# Altium schematic sheet ZHSD-ZYNQ-PWR.SchDoc
size A3; DocumentNumber: 3; SheetNumber: 3; SheetTotal: 17; Size: A3
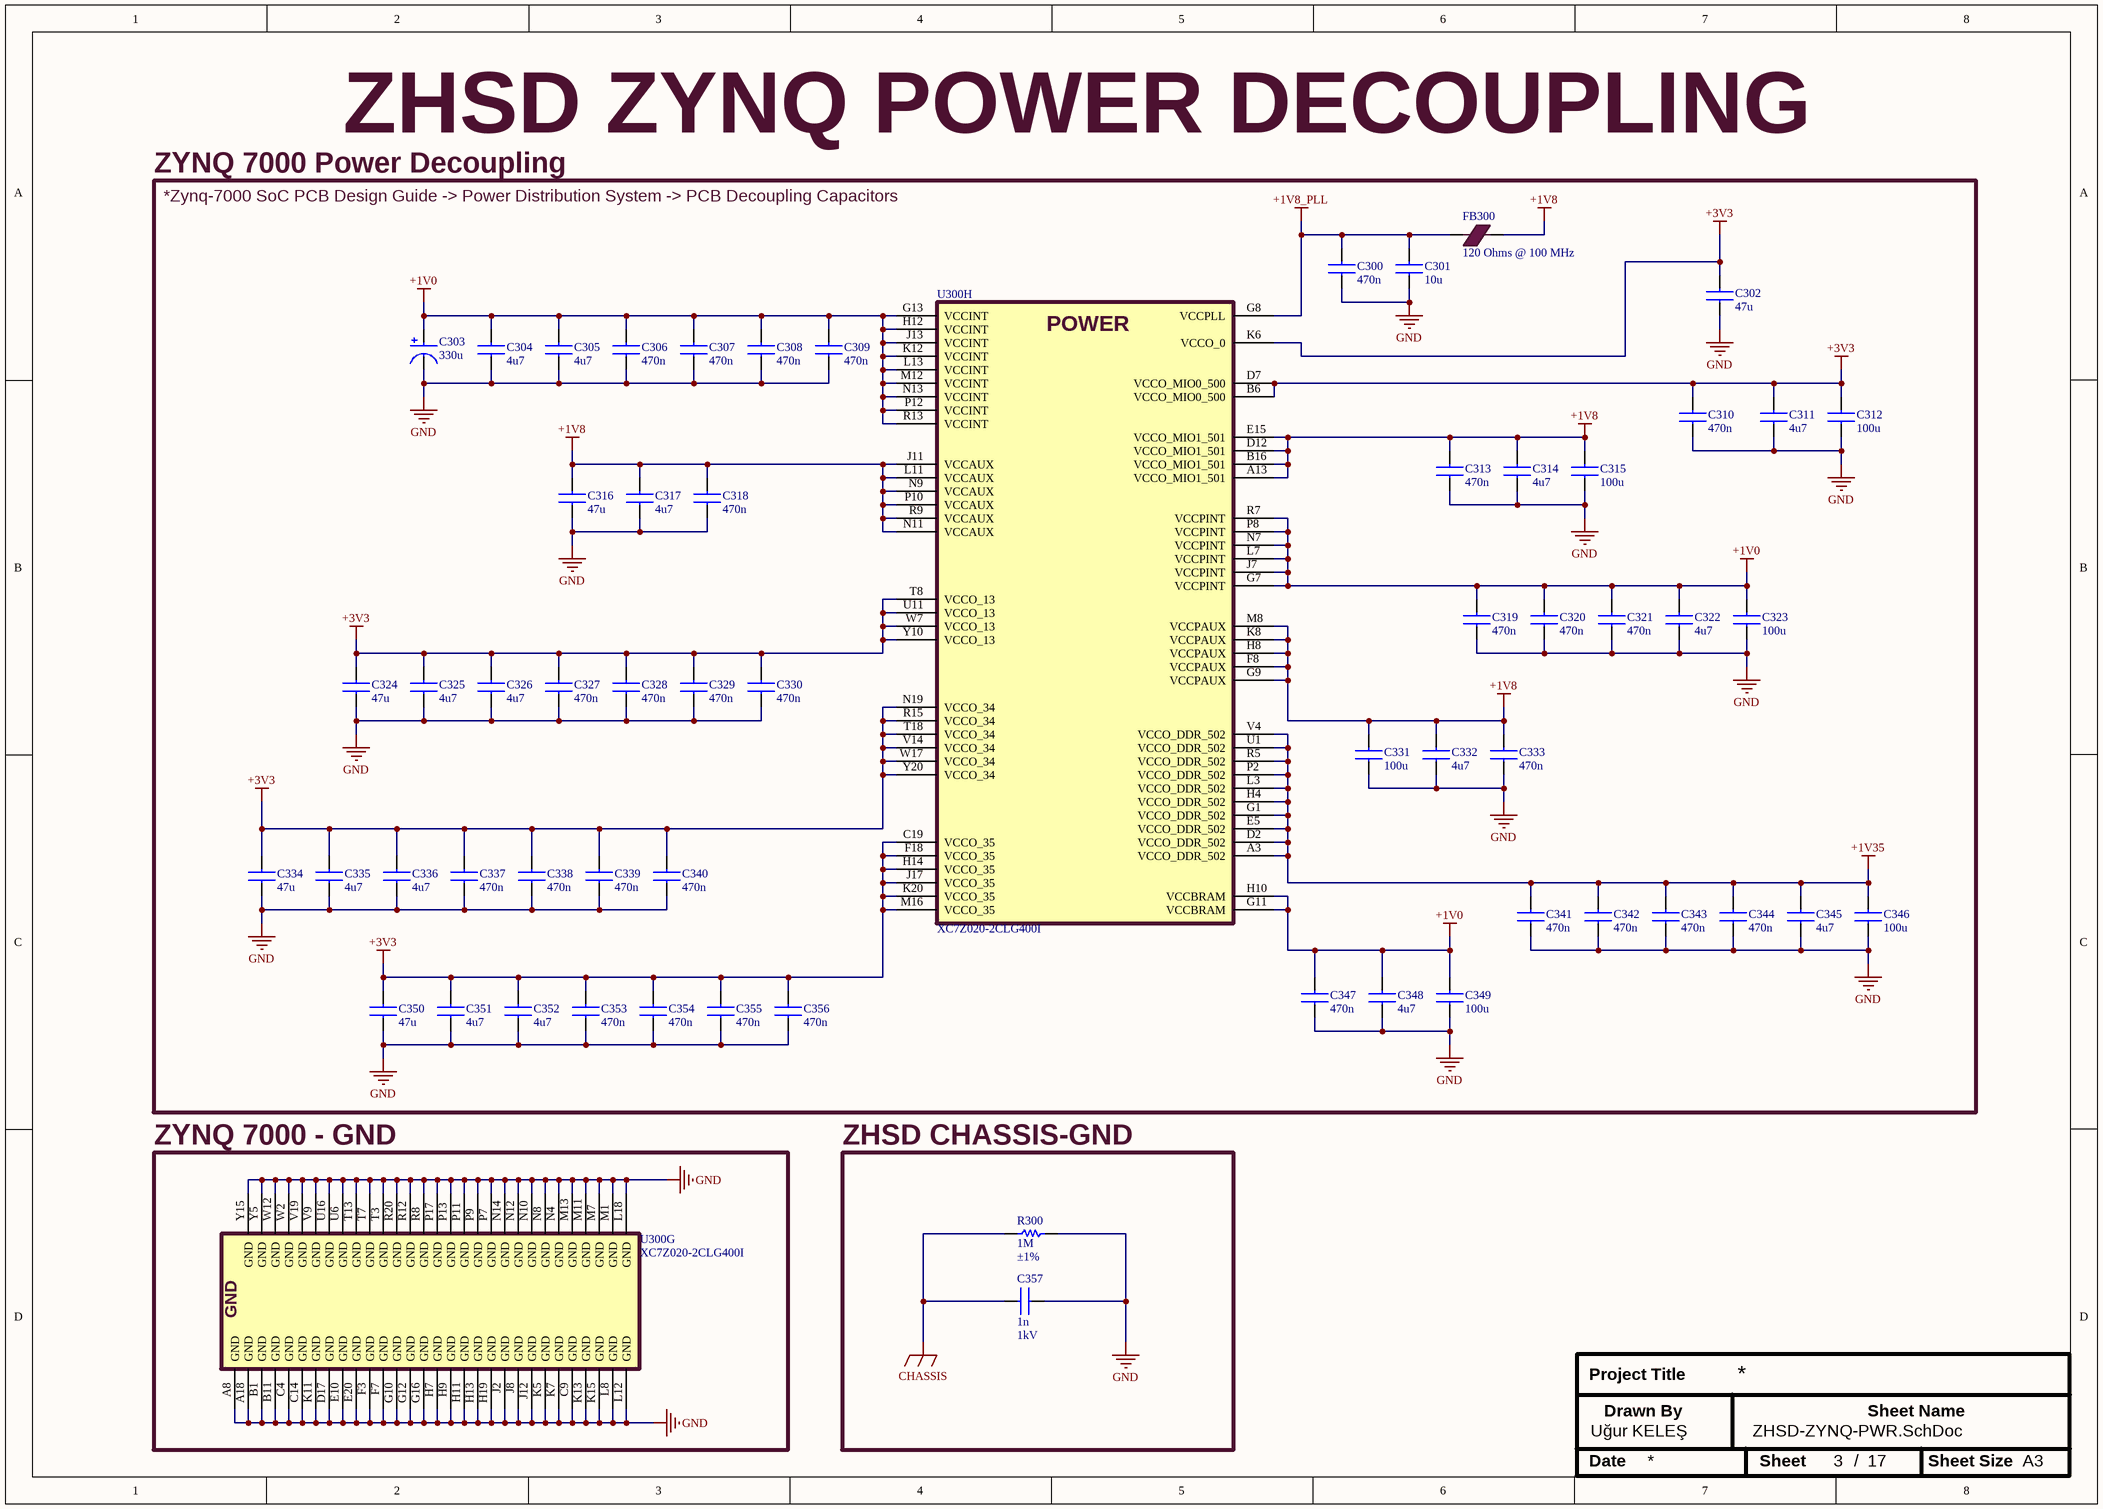
[diagram p0: ZHSD-ZYNQ-PWR.SchDoc]

## Parts
C300  470n  [0402CAPC1005X06N]
C301  10u  [0603CAPC1608X09N]
C302  47u  [1210CAPC3225X27N]
C303  330u  [T525D337M006ATE025]
C304  4u7  [0603CAPC1608X09N]
C305  4u7  [0603CAPC1608X09N]
C306  470n  [0402CAPC1005X06N]
C307  470n  [0402CAPC1005X06N]
C308  470n  [0402CAPC1005X06N]
C309  470n  [0402CAPC1005X06N]
C310  470n  [0402CAPC1005X06N]
C311  4u7  [0603CAPC1608X09N]
C312  100u  [1210CAPC3225X27N]
C313  470n  [0402CAPC1005X06N]
C314  4u7  [0603CAPC1608X09N]
C315  100u  [1210CAPC3225X27N]
C316  47u  [1210CAPC3225X27N]
C317  4u7  [0603CAPC1608X09N]
C318  470n  [0402CAPC1005X06N]
C319  470n  [0402CAPC1005X06N]
C320  470n  [0402CAPC1005X06N]
C321  470n  [0402CAPC1005X06N]
C322  4u7  [0603CAPC1608X09N]
C323  100u  [1210CAPC3225X27N]
C324  47u  [1210CAPC3225X27N]
C325  4u7  [0603CAPC1608X09N]
C326  4u7  [0603CAPC1608X09N]
C327  470n  [0402CAPC1005X06N]
C328  470n  [0402CAPC1005X06N]
C329  470n  [0402CAPC1005X06N]
C330  470n  [0402CAPC1005X06N]
C331  100u  [1210CAPC3225X27N]
C332  4u7  [0603CAPC1608X09N]
C333  470n  [0402CAPC1005X06N]
C334  47u  [1210CAPC3225X27N]
C335  4u7  [0603CAPC1608X09N]
C336  4u7  [0603CAPC1608X09N]
C337  470n  [0402CAPC1005X06N]
C338  470n  [0402CAPC1005X06N]
C339  470n  [0402CAPC1005X06N]
C340  470n  [0402CAPC1005X06N]
C341  470n  [0402CAPC1005X06N]
C342  470n  [0402CAPC1005X06N]
C343  470n  [0402CAPC1005X06N]
C344  470n  [0402CAPC1005X06N]
C345  4u7  [0603CAPC1608X09N]
C346  100u  [1210CAPC3225X27N]
C347  470n  [0402CAPC1005X06N]
C348  4u7  [0603CAPC1608X09N]
C349  100u  [1210CAPC3225X27N]
C350  47u  [1210CAPC3225X27N]
C351  4u7  [0603CAPC1608X09N]
C352  4u7  [0603CAPC1608X09N]
C353  470n  [0402CAPC1005X06N]
C354  470n  [0402CAPC1005X06N]
C355  470n  [0402CAPC1005X06N]
C356  470n  [0402CAPC1005X06N]
C357  1n  Voltage: 1kV  [0805CAPC2012X14N]
FB300  120 Ohms @ 100 MHz  [0603INDC1608X08N]
R300  1M  Tolerance: ±1%  [0603RESC1608X05N]
U300  XC7Z020-2CLG400I  [BGA400C80P20X20_1700X1700X147]  (parts G,H of 8)

## Blocks framed on the sheet
ZYNQ 7000 Power Decoupling: C300-C356 FB300 U300
ZYNQ 7000 - GND: U300
ZHSD CHASSIS-GND: C357 R300

## Nets
+1V0: C303.1 C304.2 C305.2 C306.2 C307.2 C308.2 C309.2 C319.2 C320.2 C321.2 C322.2 C323.1 C347.2 C348.2 C349.1 U300.G7(VCCPINT) U300.G11(VCCBRAM) U300.G13(VCCINT) U300.H10(VCCBRAM) U300.H12(VCCINT) U300.J7(VCCPINT) U300.J13(VCCINT) U300.K12(VCCINT) U300.L7(VCCPINT) U300.L13(VCCINT) U300.M12(VCCINT) U300.N7(VCCPINT) U300.N13(VCCINT) U300.P8(VCCPINT) U300.P12(VCCINT) U300.R7(VCCPINT) U300.R13(VCCINT)
+1V8: C313.2 C314.2 C315.1 C316.2 C317.2 C318.2 C331.1 C332.2 C333.2 FB300.2 U300.A13(VCCO_MIO1_501) U300.B16(VCCO_MIO1_501) U300.D12(VCCO_MIO1_501) U300.E15(VCCO_MIO1_501) U300.F8(VCCPAUX) U300.G9(VCCPAUX) U300.H8(VCCPAUX) U300.J11(VCCAUX) U300.K8(VCCPAUX) U300.L11(VCCAUX) U300.M8(VCCPAUX) U300.N9(VCCAUX) U300.N11(VCCAUX) U300.P10(VCCAUX) U300.R9(VCCAUX)
+1V8_PLL: C300.2 C301.2 FB300.1 U300.G8(VCCPLL)
+1V35: C341.2 C342.2 C343.2 C344.2 C345.2 C346.1 U300.A3(VCCO_DDR_502) U300.D2(VCCO_DDR_502) U300.E5(VCCO_DDR_502) U300.G1(VCCO_DDR_502) U300.H4(VCCO_DDR_502) U300.L3(VCCO_DDR_502) U300.P2(VCCO_DDR_502) U300.R5(VCCO_DDR_502) U300.U1(VCCO_DDR_502) U300.V4(VCCO_DDR_502)
+3V3: C302.2 C310.2 C311.2 C312.1 C324.2 C325.2 C326.2 C327.2 C328.2 C329.2 C330.2 C334.2 C335.2 C336.2 C337.2 C338.2 C339.2 C340.2 C350.2 C351.2 C352.2 C353.2 C354.2 C355.2 C356.2 U300.B6(VCCO_MIO0_500) U300.C19(VCCO_35) U300.D7(VCCO_MIO0_500) U300.F18(VCCO_35) U300.H14(VCCO_35) U300.J17(VCCO_35) U300.K6(VCCO_0) U300.K20(VCCO_35) U300.M16(VCCO_35) U300.N19(VCCO_34) U300.R15(VCCO_34) U300.T8(VCCO_13) U300.T18(VCCO_34) U300.U11(VCCO_13) U300.V14(VCCO_34) U300.W7(VCCO_13) U300.W17(VCCO_34) U300.Y10(VCCO_13) U300.Y20(VCCO_34)
CHASSIS: C357.2 R300.1
GND: C300.1 C301.1 C302.1 C303.2 C304.1 C305.1 C306.1 C307.1 C308.1 C309.1 C310.1 C311.1 C312.2 C313.1 C314.1 C315.2 C316.1 C317.1 C318.1 C319.1 C320.1 C321.1 C322.1 C323.2 C324.1 C325.1 C326.1 C327.1 C328.1 C329.1 C330.1 C331.2 C332.1 C333.1 C334.1 C335.1 C336.1 C337.1 C338.1 C339.1 C340.1 C341.1 C342.1 C343.1 C344.1 C345.1 C346.2 C347.1 C348.1 C349.2 C350.1 C351.1 C352.1 C353.1 C354.1 C355.1 C356.1 C357.1 R300.2 U300.A8(GND) U300.A18(GND) U300.B1(GND) U300.B11(GND) U300.C4(GND) U300.C9(GND) U300.C14(GND) U300.D17(GND) U300.E10(GND) U300.E20(GND) U300.F3(GND) U300.F7(GND) U300.G10(GND) U300.G12(GND) U300.G16(GND) U300.H7(GND) U300.H9(GND) U300.H11(GND) U300.H13(GND) U300.H19(GND) U300.J2(GND) U300.J8(GND) U300.J12(GND) U300.K5(GND) U300.K7(GND) U300.K11(GND) U300.K13(GND) U300.K15(GND) U300.L8(GND) U300.L12(GND) U300.L18(GND) U300.M1(GND) U300.M7(GND) U300.M11(GND) U300.M13(GND) U300.N4(GND) U300.N8(GND) U300.N10(GND) U300.N12(GND) U300.N14(GND) U300.P7(GND) U300.P9(GND) U300.P11(GND) U300.P13(GND) U300.P17(GND) U300.R8(GND) U300.R12(GND) U300.R20(GND) U300.T3(GND) U300.T7(GND) U300.T13(GND) U300.U6(GND) U300.U16(GND) U300.V9(GND) U300.V19(GND) U300.W2(GND) U300.W12(GND) U300.Y5(GND) U300.Y15(GND)

## Notes on the sheet
- ZHSD ZYNQ POWER DECOUPLING
- *Zynq-7000 SoC PCB Design Guide -> Power Distribution System -> PCB Decoupling Capacitors
- Project Title
- Uğur KELEŞ
- Drawn By
- Sheet Name
- Date
- Sheet
- /
- Sheet Size
- A3
- (in symbol XC7Z020-2CLG400I, part H) POWER

## Library data of the parts
C300 C306-C310 C313 C318-C321 C327-C330 C333 C337-C344 C347 C353-C356 = GRM155R60J474KE19D: CAP CER 0.47UF 6.3V X5R 0402(1005) ±10%; Manufacturer: Murata Electronics; Value: 0.47 µF; ComponentLink1Description: Datasheet; ComponentLink1URL: https://search.murata.co.jp/Ceramy/image/img/A01X/G101/ENG/GRM21BR71A475KE51-01.pdf; MPN: GRM155R60J474KE19D; Package: 0402; Tolerance: ±10%; Voltage: 6.3V
C301 = GRM188R60G106ME47D: CAP CER 10UF 4V X5R 0603 (1608) ±20%; Manufacturer: Murata Electronics; Value: 10 µF; ComponentLink1Description: Datasheet; ComponentLink1URL: https://search.murata.co.jp/Ceramy/image/img/A01X/G101/ENG/GRM188R60G106ME47-01.pdf; MPN: GRM188R60G106ME47D; Package: 0603; Tolerance: ±20%; Voltage: 4V
C302 C316 C324 C334 C350 = GRM32ER70J476ME20L: CAP CER 47UF 6.3V X7R 1210 1210 (3225) ±20%; Manufacturer: Murata Electronics; Value: 47 µF; ComponentLink1Description: Datasheet; ComponentLink1URL: https://search.murata.co.jp/Ceramy/image/img/A01X/G101/ENG/GRM32ER70J476ME20-01.pdf; MPN: GRM32ER70J476ME20L; Package: 1210; Tolerance: ±20%; Voltage: 6.3V
C303 = T525D337M006ATE025: CAP TANT POLY 330UF 6.3V 2917 (7343) ±20%; Manufacturer: KEMET; ESR: 25mOhm @ 100kHz; Value: 330 µF; ComponentLink1Description: Datasheet; ComponentLink1URL: https://search.kemet.com/download/specsheet/T525D337M006ATE025; MPN: T525D337M006ATE025; Package: 2917; Tolerance: ±20%; Voltage: 6.3 V
C304 C305 C311 C314 C317 C322 C325 C326 C332 C335 C336 C345 C348 C351 C352 = CL10A475KP8NNNC: CAP CER 4.7UF 10V X5R 0603 (1608) ±10%; Manufacturer: Samsung Electro-Mechanics; Value: 4.7 µF; ComponentLink1Description: Datasheet; ComponentLink1URL: https://mm.digikey.com/Volume0/opasdata/d220001/medias/docus/609/CL10A475KP8NNNC_Spec.pdf; MPN: CL10A475KP8NNNC; Package: 0603; Tolerance: ±10%; Voltage: 10V
C312 C315 C323 C331 C346 C349 = GRM32EE70G107ME19L: CAP CER 100UF 4V X7U 1210 (3225) ±20%; Manufacturer: Murata Electronics; Value: 100 µF; ComponentLink1Description: Datasheet; ComponentLink1URL: https://search.murata.co.jp/Ceramy/image/img/A01X/G101/ENG/GRM32EE70G107ME19-01.pdf; MPN: GRM32EE70G107ME19L; Package: 1210; Tolerance: ±20%; Voltage: 4V
C357 = CC0805KRX7RCBB102: CAP CER 1000PF 1KV X7R 0805 (2012) ±10%; Manufacturer: YAGEO; ComponentLink1Description: Datasheet; ComponentLink1URL: https://search.murata.co.jp/Ceramy/image/img/A01X/G101/ENG/GRM21BR71A475KE51-01.pdf; MPN: CC0805KRX7RCBB102; Package: 0805; Tolerance: ±10%; Value: 1000 pF
FB300 = BLM18SG121TN1D: FERRITE BEAD 120 OHM 0603 (1608) 3A 25mOhm; Manufacturer: Murata Electronics; ComponentLink1Description: Datasheet; ComponentLink1URL: https://pim.murata.com/asset/pim4/ferriteBeadInductortypefilter/ENFA0003_PDF_FERRITEBEADINDUCTORTYPEFILTER?lastModifiedDatetime=20250707190934; ComponentLink2Description: Website; ComponentLink2URL: https://pim.murata.com/en-global/pim/details/?partNum=BLM18SG121TN1%23; Current Rating (Max): 3A; DC Resistance (DCR) (Max): 25mOhm; Impedance @ Frequency: 120 Ohms @ 100 MHz; MPN: BLM18SG121TN1D; Package: 0603
R300 = CRCW06031M00FKEA: RES SMD 1M OHM 1% 1/8W 0603 (1608); Manufacturer: Vishay Dale; Value: 1 MOhms; Voltage: 75V; ComponentLink1Description: Datasheet; ComponentLink1URL: https://www.vishay.com/docs/20035/dcrcwe3.pdf; MPN: CRCW06031M00FKEA; Package: 0603
U300 = XC7Z020-2CLG400I: Dual ARM® Cortex®-A9 MPCore™ with CoreSight™ System On Chip (SOC) IC Zynq®-7000 Artix™-7 FPGA, 85K Logic Cells 766MHz 400-CSPBGA (17x17); Manufacturer: AMD/XILINX; MPN: XC7Z020-2CLG400I; ComponentLink1Description: Datasheet; ComponentLink1URL: https://docs.amd.com/v/u/en-US/ds190-Zynq-7000-Overview; ComponentLink2Description: DC and AC Switching Characteristics; ComponentLink2URL: https://docs.amd.com/v/u/en-US/ds187-XC7Z010-XC7Z020-Data-Sheet; ComponentLink3Description: PCB Design Guide; ComponentLink3URL: https://docs.amd.com/v/u/en-US/ug933-Zynq-7000-PCB; ComponentLink4Description: Packaging and Pinout; ComponentLink4URL: https://docs.amd.com/v/u/en-US/ug865-Zynq-7000-Pkg-Pinout; ComponentLink5Description: Zynq 7000 SoC Technical Reference Manual; ComponentLink5URL: https://docs.amd.com/r/en-US/ug585-zynq-7000-SoC-TRM